# EAGLE schematic LMD18200_4 (EAGLE 7.7.0)
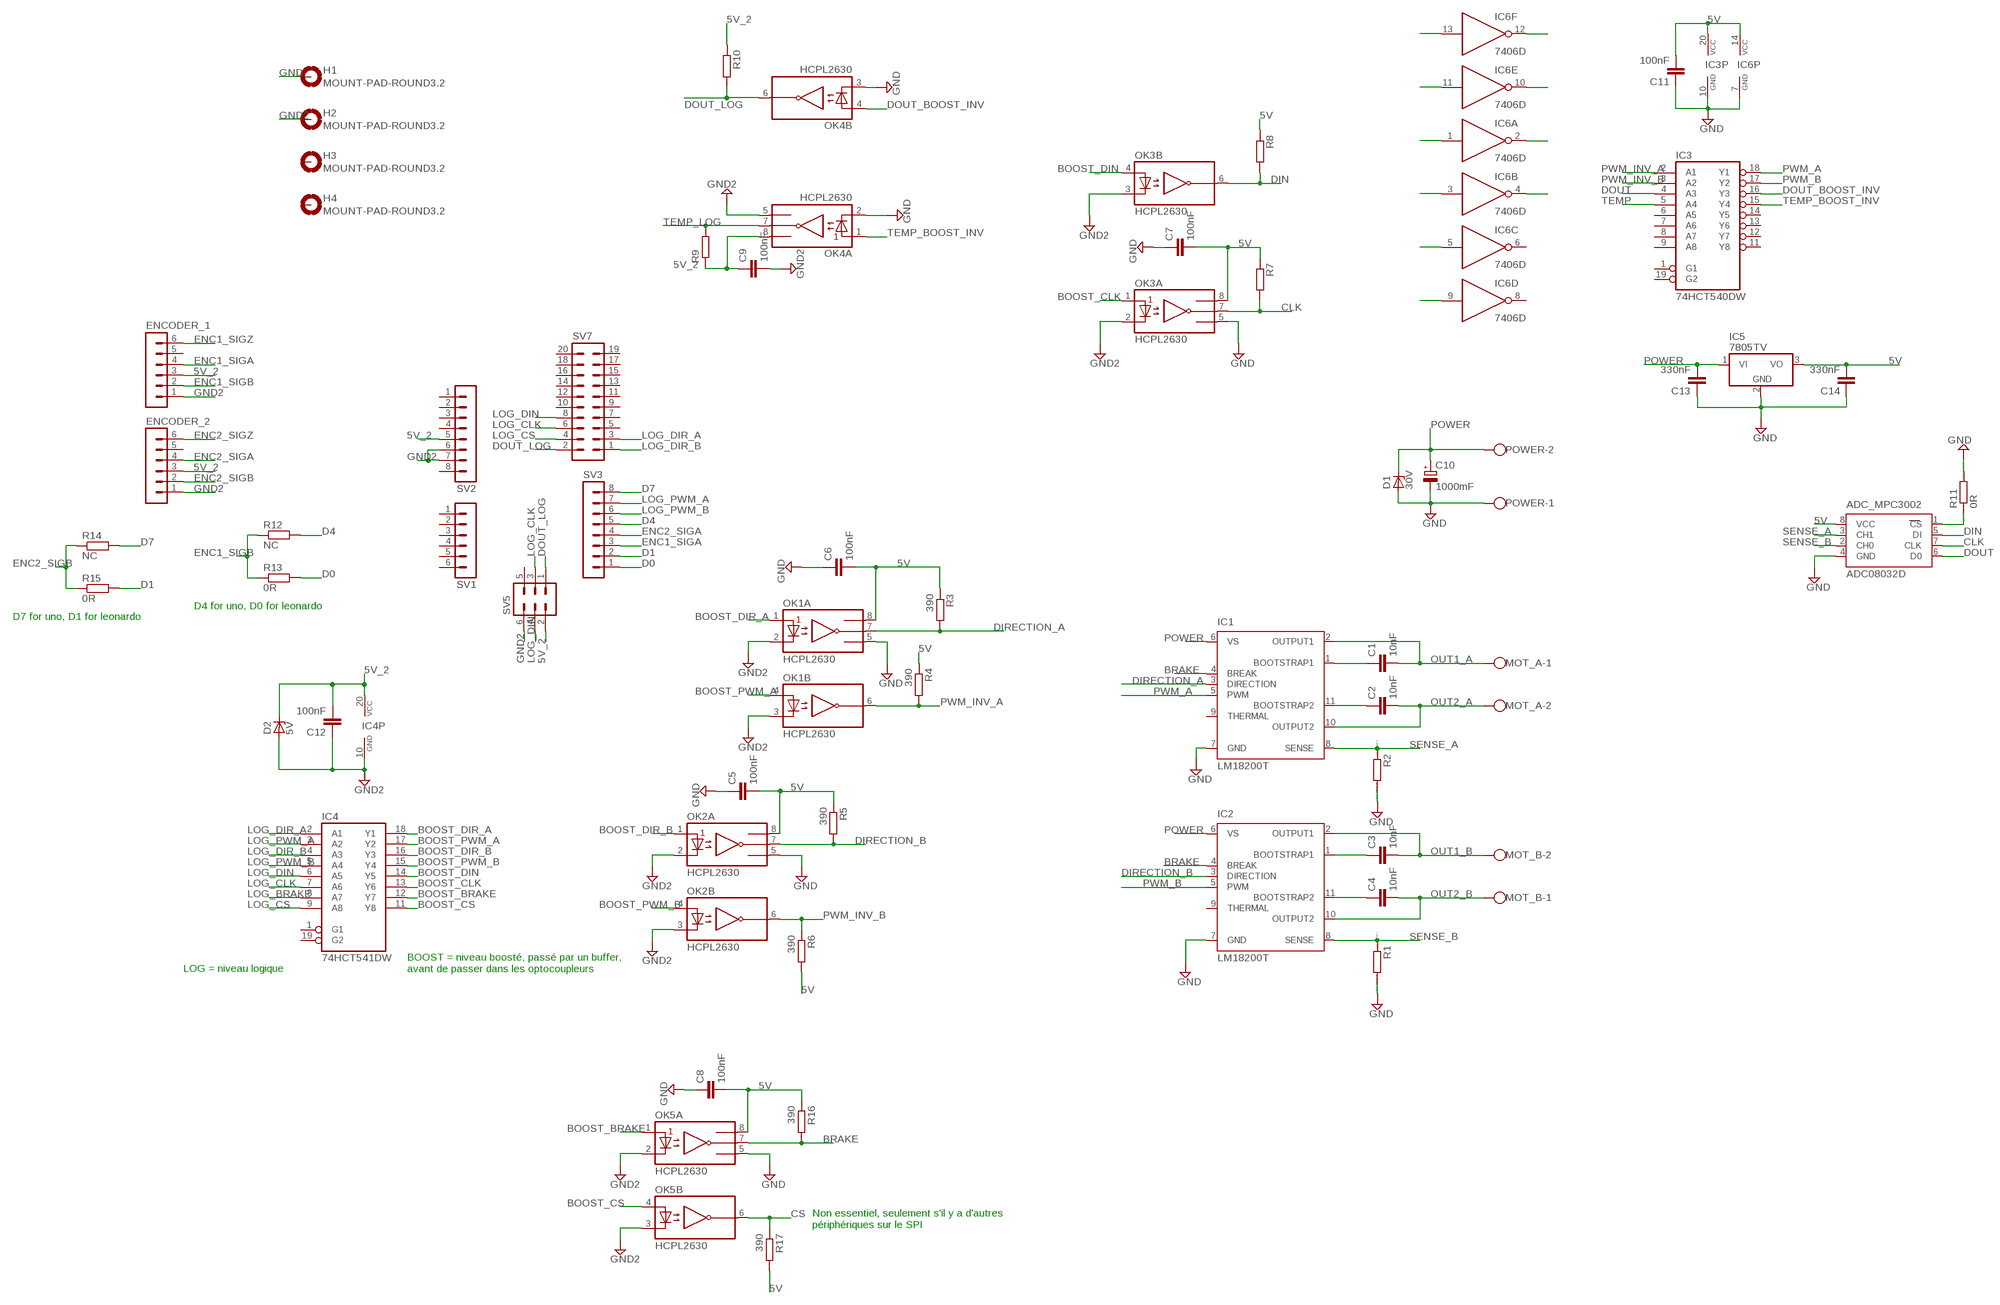
[diagram p0: schematic, sheet 1]

## Parts
ADC_MPC3002  ADC08032D  [SO08]
C1  10nF  C2.5/2  [C2.5-2]
C2  10nF  C2.5/2  [C2.5-2]
C3  10nF  C2.5/2  [C2.5-2]
C4  10nF  C2.5/2  [C2.5-2]
C5  100nF  C2.5/2  [C2.5-2]
C6  100nF  C2.5/2  [C2.5-2]
C7  100nF  C2.5/2  [C2.5-2]
C8  100nF  C2.5/2  [C2.5-2]
C9  100nF  C2.5/2  [C2.5-2]
C10  1000mF  CPOL-EUE7.5-18  [E7,5-18]
C11  100nF  C2.5/2  [C2.5-2]
C12  100nF  C2.5/2  [C2.5-2]
C13  330nF  C2.5/2  [C2.5-2]
C14  330nF  C2.5/2  [C2.5-2]
D1  30V  ZENER-DIODESOD80C  [SOD80C]
D2  5V  ZENER-DIODESOD80C  [SOD80C]
ENCODER_1  MA06-1  [MA06-1]
ENCODER_2  MA06-1  [MA06-1]
H1  MOUNT-PAD-ROUND3.2  [3,2-PAD]
H2  MOUNT-PAD-ROUND3.2  [3,2-PAD]
H3  MOUNT-PAD-ROUND3.2  [3,2-PAD]
H4  MOUNT-PAD-ROUND3.2  [3,2-PAD]
IC1  LM18200T  [TO-220-11]
IC2  LM18200T  [TO-220-11]
IC3  74HCT540DW  [SO20W]
IC4  74HCT541DW  [SO20W]
IC5  7805TV  [TO220V]
IC6  7406D  [SO14]
MOT_A  W237-102  [W237-102]
MOT_B  W237-102  [W237-102]
OK1  HCPL2630  [DIL08]
OK2  HCPL2630  [DIL08]
OK3  HCPL2630  [DIL08]
OK4  HCPL2630  [DIL08]
OK5  HCPL2630  [DIL08]
POWER  W237-102  [W237-102]
R1  R  [R0805]
R2  R  [R0805]
R3  390  R-EU_R0805  [R0805]
R4  390  R-EU_R0805  [R0805]
R5  390  R-EU_R0805  [R0805]
R6  390  R-EU_R0805  [R0805]
R7  R-EU_R0805  [R0805]
R8  R-EU_R0805  [R0805]
R9  R-EU_R0805  [R0805]
R10  R-EU_R0805  [R0805]
R11  0R  R  [R0805]
R12  NC  R-EU_R0805  [R0805]
R13  0R  R-EU_R0805  [R0805]
R14  NC  R-EU_R0805  [R0805]
R15  0R  R-EU_R0805  [R0805]
R16  390  R-EU_R0805  [R0805]
R17  390  R-EU_R0805  [R0805]
SV1  MA06-1  [MA06-1]
SV2  MA08-1  [MA08-1]
SV3  MA08-1  [MA08-1]
SV5  MA03-2  [MA03-2]
SV7  MA10-2  [MA10-2]

## Nets
5V: ADC_MPC3002.8(VCC) C5.2 C6.2 C7.2 C8.2 C11.2 C14.2 IC3.20(VCC) IC5.3(VO) IC6.14(P:VCC) OK1.8(A:VCC) OK2.8(A:VCC) OK3.8(A:VCC) OK5.8(A:VCC) R3.1 R4.1 R5.1 R6.2 R7.1 R8.1 R16.1 R17.2
5V_2: C9.1 C12.2 D2.C ENCODER_1.3 ENCODER_2.3 IC4.20(VCC) OK4.8(A:VCC) R9.1 R10.1 SV2.5 SV5.2
BOOST_BRAKE: IC4.12(Y7) OK5.1(A:A1)
BOOST_CLK: IC4.13(Y6) OK3.1(A:A1)
BOOST_CS: IC4.11(Y8) OK5.4(B:A2)
BOOST_DIN: IC4.14(Y5) OK3.4(B:A2)
BOOST_DIR_A: IC4.18(Y1) OK1.1(A:A1)
BOOST_DIR_B: IC4.16(Y3) OK2.1(A:A1)
BOOST_PWM_A: IC4.17(Y2) OK1.4(B:A2)
BOOST_PWM_B: IC4.15(Y4) OK2.4(B:A2)
BRAKE: IC1.4(BREAK) IC2.4(BREAK) OK5.7(A:VO1) R16.2
CLK: ADC_MPC3002.7(CLK) OK3.7(A:VO1) R7.2
CS: ADC_MPC3002.1(CS) OK5.6(B:VO2) R11.1 R17.1
D0: R13.2 SV3.1
D1: R15.2 SV3.2
D4: R12.2 SV3.5
D7: R14.2 SV3.8
DIN: ADC_MPC3002.5(DI) OK3.6(B:VO2) R8.2
DIRECTION_A: IC1.3(DIRECTION) OK1.7(A:VO1) R3.2
DIRECTION_B: IC2.3(DIRECTION) OK2.7(A:VO1) R5.2
DOUT: ADC_MPC3002.6(D0) IC3.4(A3)
DOUT_BOOST_INV: IC3.16(Y3) OK4.4(B:A2)
DOUT_LOG: OK4.6(B:VO2) R10.2 SV5.1 SV7.2
ENC1_SIGA: ENCODER_1.4 SV3.3
ENC1_SIGB: ENCODER_1.2 R12.1 R13.1
ENC1_SIGZ: ENCODER_1.6
ENC2_SIGA: ENCODER_2.4 SV3.4
ENC2_SIGB: ENCODER_2.2 R14.1 R15.1
ENC2_SIGZ: ENCODER_2.6
GND: ADC_MPC3002.4(GND) C5.1 C6.1 C7.1 C8.1 C10.- C11.1 C13.1 C14.1 D1.A H1.B3,2(MOUNT) IC1.7(GND) IC2.7(GND) IC3.10(GND) IC5.2(GND) IC6.7(P:GND) OK1.5(A:GND) OK2.5(A:GND) OK3.5(A:GND) OK4.2(A:C1) OK4.3(B:C2) OK5.5(A:GND) POWER.1 R1.2 R2.2 R11.2
GND2: C9.2 C12.1 D2.A ENCODER_1.1 ENCODER_2.1 H2.B3,2(MOUNT) IC4.10(GND) OK1.2(A:C1) OK1.3(B:C2) OK2.2(A:C1) OK2.3(B:C2) OK3.2(A:C1) OK3.3(B:C2) OK4.5(A:GND) OK5.2(A:C1) OK5.3(B:C2) SV2.6 SV2.7 SV5.6
LOG_BRAKE: IC4.8(A7)
LOG_CLK: IC4.7(A6) SV5.3 SV7.6
LOG_CS: IC4.9(A8) SV7.4
LOG_DIN: IC4.6(A5) SV5.4 SV7.8
LOG_DIR_A: IC4.2(A1) SV7.3
LOG_DIR_B: IC4.4(A3) SV7.1
LOG_PWM_A: IC4.3(A2) SV3.7
LOG_PWM_B: IC4.5(A4) SV3.6
N$1: IC6.13(F:I)
N$2: IC6.11(E:I)
N$3: IC6.1(A:I)
N$4: C1.1 IC1.1(BOOTSTRAP1)
N$5: IC6.3(B:I)
N$6: IC6.5(C:I)
N$7: IC6.9(D:I)
N$8: C2.1 IC1.11(BOOTSTRAP2)
N$9: C3.1 IC2.1(BOOTSTRAP1)
N$10: C4.1 IC2.11(BOOTSTRAP2)
N$11: IC6.12(F:O)
N$12: IC6.10(E:O)
N$13: IC6.2(A:O)
N$14: IC6.4(B:O)
OUT1_A: C1.2 IC1.2(OUTPUT1) MOT_A.1
OUT1_B: C3.2 IC2.2(OUTPUT1) MOT_B.2
OUT2_A: C2.2 IC1.10(OUTPUT2) MOT_A.2
OUT2_B: C4.2 IC2.10(OUTPUT2) MOT_B.1
POWER: C10.+ C13.2 D1.C IC1.6(VS) IC2.6(VS) IC5.1(VI) POWER.2
PWM_A: IC1.5(PWM) IC3.18(Y1)
PWM_B: IC2.5(PWM) IC3.17(Y2)
PWM_INV_A: IC3.2(A1) OK1.6(B:VO2) R4.2
PWM_INV_B: IC3.3(A2) OK2.6(B:VO2) R6.1
SENSE_A: ADC_MPC3002.3(CH1) IC1.8(SENSE) R2.1
SENSE_B: ADC_MPC3002.2(CH0) IC2.8(SENSE) R1.1
TEMP: IC3.5(A4)
TEMP_BOOST_INV: IC3.15(Y4) OK4.1(A:A1)
TEMP_LOG: OK4.7(A:VO1) R9.2
Unconnected: ENCODER_1.5 ENCODER_2.5 H3.B3,2(MOUNT) H4.B3,2(MOUNT) IC1.9(THERMAL) IC2.9(THERMAL) IC3.1(G1) IC3.6(A5) IC3.7(A6) IC3.8(A7) IC3.9(A8) IC3.11(Y8) IC3.12(Y7) IC3.13(Y6) IC3.14(Y5) IC3.19(G2) IC4.1(G1) IC4.19(G2) IC6.6(C:O) IC6.8(D:O) SV1.1 SV1.2 SV1.3 SV1.4 SV1.5 SV1.6 SV2.1 SV2.2 SV2.3 SV2.4 SV2.8 SV5.5 SV7.5 SV7.7 SV7.9 SV7.10 SV7.11 SV7.12 SV7.13 SV7.14 SV7.15 SV7.16 SV7.17 SV7.18 SV7.19 SV7.20

## Notes on the sheet
- D4 for uno, D0 for leonardo
- D7 for uno, D1 for leonardo
- LOG = niveau logique
- BOOST = niveau boosté, passé par un buffer, 
  avant de passer dans les optocoupleurs
- Non essentiel, seulement s'il y a d'autres 
  périphériques sur le SPI

## Library data of the parts
ADC_MPC3002 = linear:ADC08032: A/D CONVERTER
C1-C9 C11-C14 = capacitor-wima:C: CAPACITOR naming: grid - package width
C10 = rcl:CPOL-EU: POLARIZED CAPACITOR, European symbol
D1 D2 = diode:ZENER-DIODE: Z-Diode
ENCODER_1 ENCODER_2 SV1 = con-lstb:MA06-1: PIN HEADER; OC_FARNELL: unknown; OC_NEWARK: unknown
H1-H4 = holes:MOUNT-PAD-ROUND: MOUNTING PAD, round
IC1 IC2 = national-semiconductor:LM18200T: 3A, 55V H-Bridge Motor Control SourcE: http://cache.national.com/ds/LM/LMD18200.pdf; OC_FARNELL: unknown; OC_NEWARK: unknown
IC3 = 74xx-eu:74*540: Inverting Octal BUFFER and LINE DRIVER, 3-state
IC4 = 74xx-eu:74*541: Octal BUFFER and LINE DRIVER, 3-state
IC5 = linear:78*: Positive VOLTAGE REGULATOR Source: http://cache.national.com/ds/LM/LM78L05.pdf http://www.fairchildsemi.com/ds/LM/LM7805.pdf
IC6 = 74xx-eu:74*06: Hex INVERTER, open collector high-voltage output
MOT_A MOT_B POWER = con-wago-500:W237-102: WAGO SCREW CLAMP; MPN: 237-102; OC_FARNELL: unknown; OC_NEWARK: 70K9898
OK1-OK5 = optocoupler:HCPL2630: HEWLETT PACKARD OPTO COUPLER; MF: AGILENT TECHNOLOGIES; MPN: HCPL-2630-000E; OC_FARNELL: 9994904; OC_NEWARK: 88H7813
R1 R2 R11 = eagle-ltspice:R: RESISTOR, European symbol; SPICEMODEL: NONE; SPICEPREFIX: R
R3-R10 R12-R17 = rcl:R-EU_: RESISTOR, European symbol
SV2 SV3 = con-lstb:MA08-1: PIN HEADER; OC_FARNELL: unknown; OC_NEWARK: unknown
SV5 = con-lstb:MA03-2: PIN HEADER; OC_FARNELL: unknown; OC_NEWARK: unknown
SV7 = con-lstb:MA10-2: PIN HEADER; OC_FARNELL: unknown; OC_NEWARK: unknown